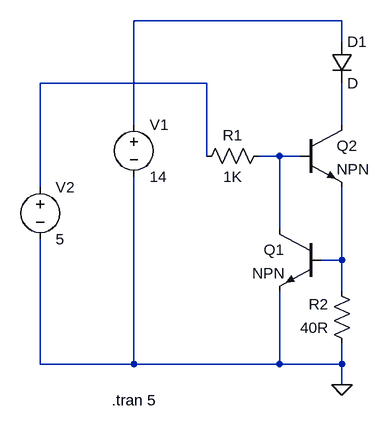
[diagram p0: schematic LED_PCB_Rev2_sim.asc]
LED_PCB_Rev2_sim.asc, the LTspice schematic file:
Version 4
SHEET 1 880 680
WIRE 288 -192 -32 -192
WIRE 288 -160 288 -192
WIRE 80 -96 -176 -96
WIRE -32 -32 -32 -192
WIRE 288 -32 288 -96
WIRE 80 16 80 -96
WIRE 192 16 160 16
WIRE 224 16 192 16
WIRE -176 64 -176 -96
WIRE 192 128 192 16
WIRE 288 176 288 64
WIRE 288 176 256 176
WIRE 288 224 288 176
WIRE -176 336 -176 144
WIRE -32 336 -32 48
WIRE -32 336 -176 336
WIRE 192 336 192 224
WIRE 192 336 -32 336
WIRE 288 336 288 304
WIRE 288 336 192 336
WIRE 288 368 288 336
FLAG 288 368 0
SYMBOL diode 272 -160 R0
SYMATTR InstName D1
SYMBOL res 176 0 R90
WINDOW 0 0 56 VBottom 2
WINDOW 3 32 56 VTop 2
SYMATTR InstName R1
SYMATTR Value 1K
SYMBOL res 304 320 R180
WINDOW 0 36 76 Left 2
WINDOW 3 36 40 Left 2
SYMATTR InstName R2
SYMATTR Value 40R
SYMBOL npn 256 128 M0
SYMATTR InstName Q1
SYMBOL voltage -32 -48 R0
WINDOW 123 0 0 Left 0
WINDOW 39 0 0 Left 0
SYMATTR InstName V1
SYMATTR Value 14
SYMBOL voltage -176 48 R0
WINDOW 123 0 0 Left 0
WINDOW 39 0 0 Left 0
SYMATTR InstName V2
SYMATTR Value 5
SYMBOL npn 224 -32 R0
SYMATTR InstName Q2
TEXT -66 392 Left 2 !.tran 5

The netlist it stands for:
* LED_PCB_Rev2_sim.asc
D1 N001 N003 D
R1 N004 N002 1K
R2 0 N005 40R
Q1 N004 N005 0 0 NPN
V1 N001 0 14
V2 N002 0 5
Q2 N003 N004 N005 0 NPN
.model D D
.lib standard.dio
.model NPN NPN
.model PNP PNP
.lib standard.bjt
.tran 5
.backanno
.end